# Altium schematic sheet ADC.SchDoc
size 558 x 431 mm; SheetNumber: 11; SheetTotal: 25; Sheet_Name: ADC; Size: 11x17
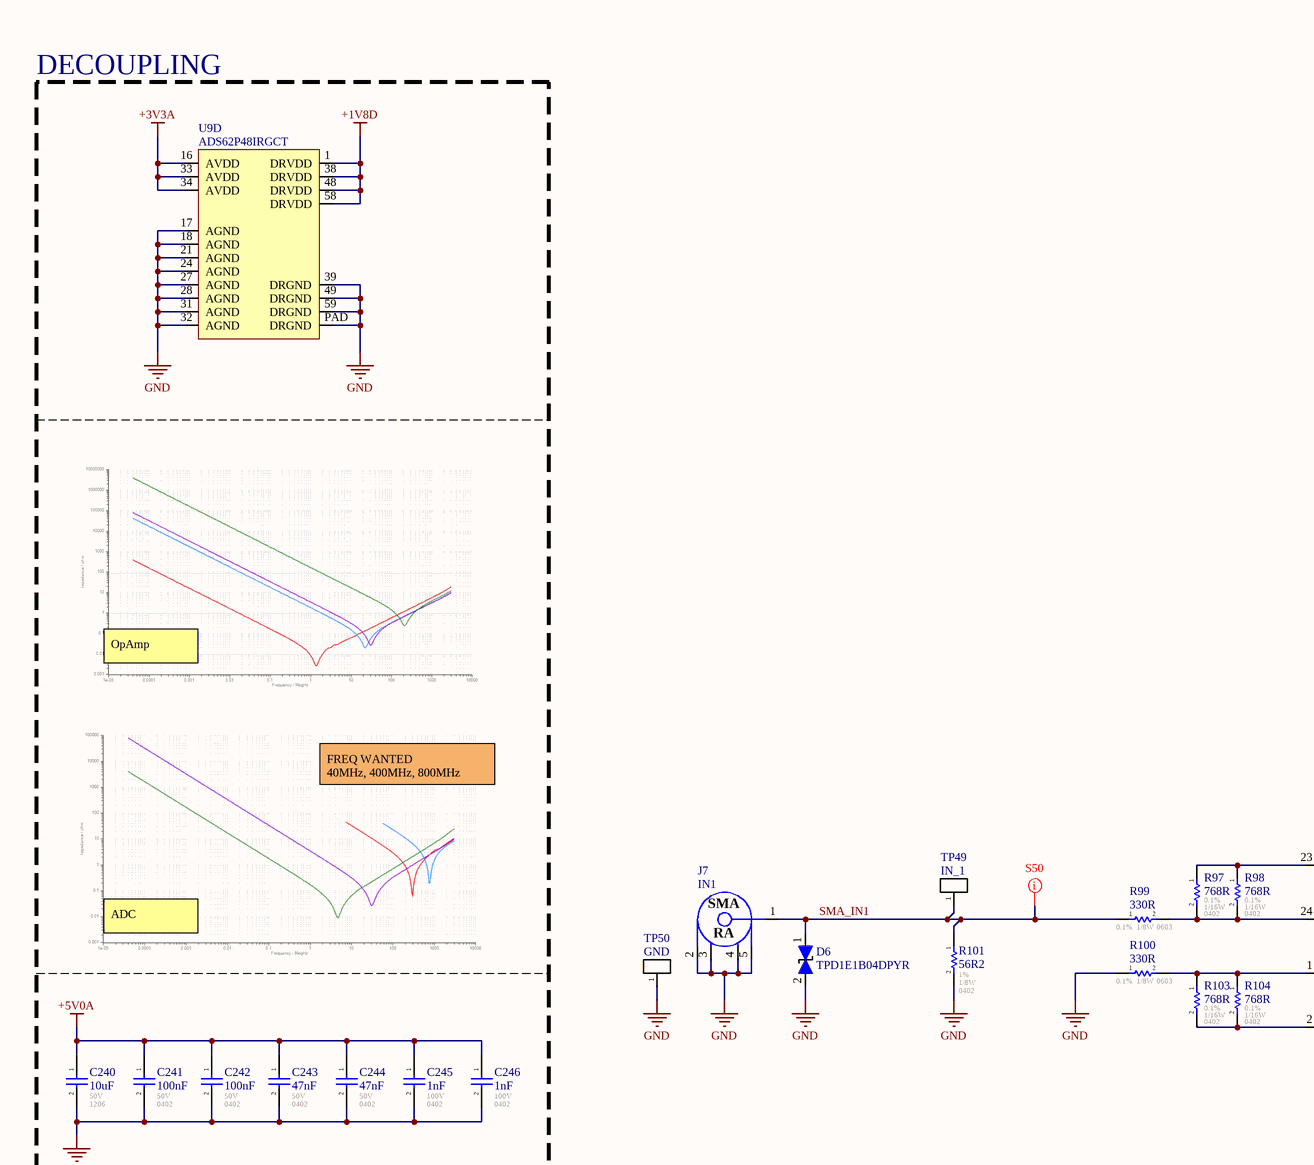
[diagram p0: ADC.SchDoc, top left]
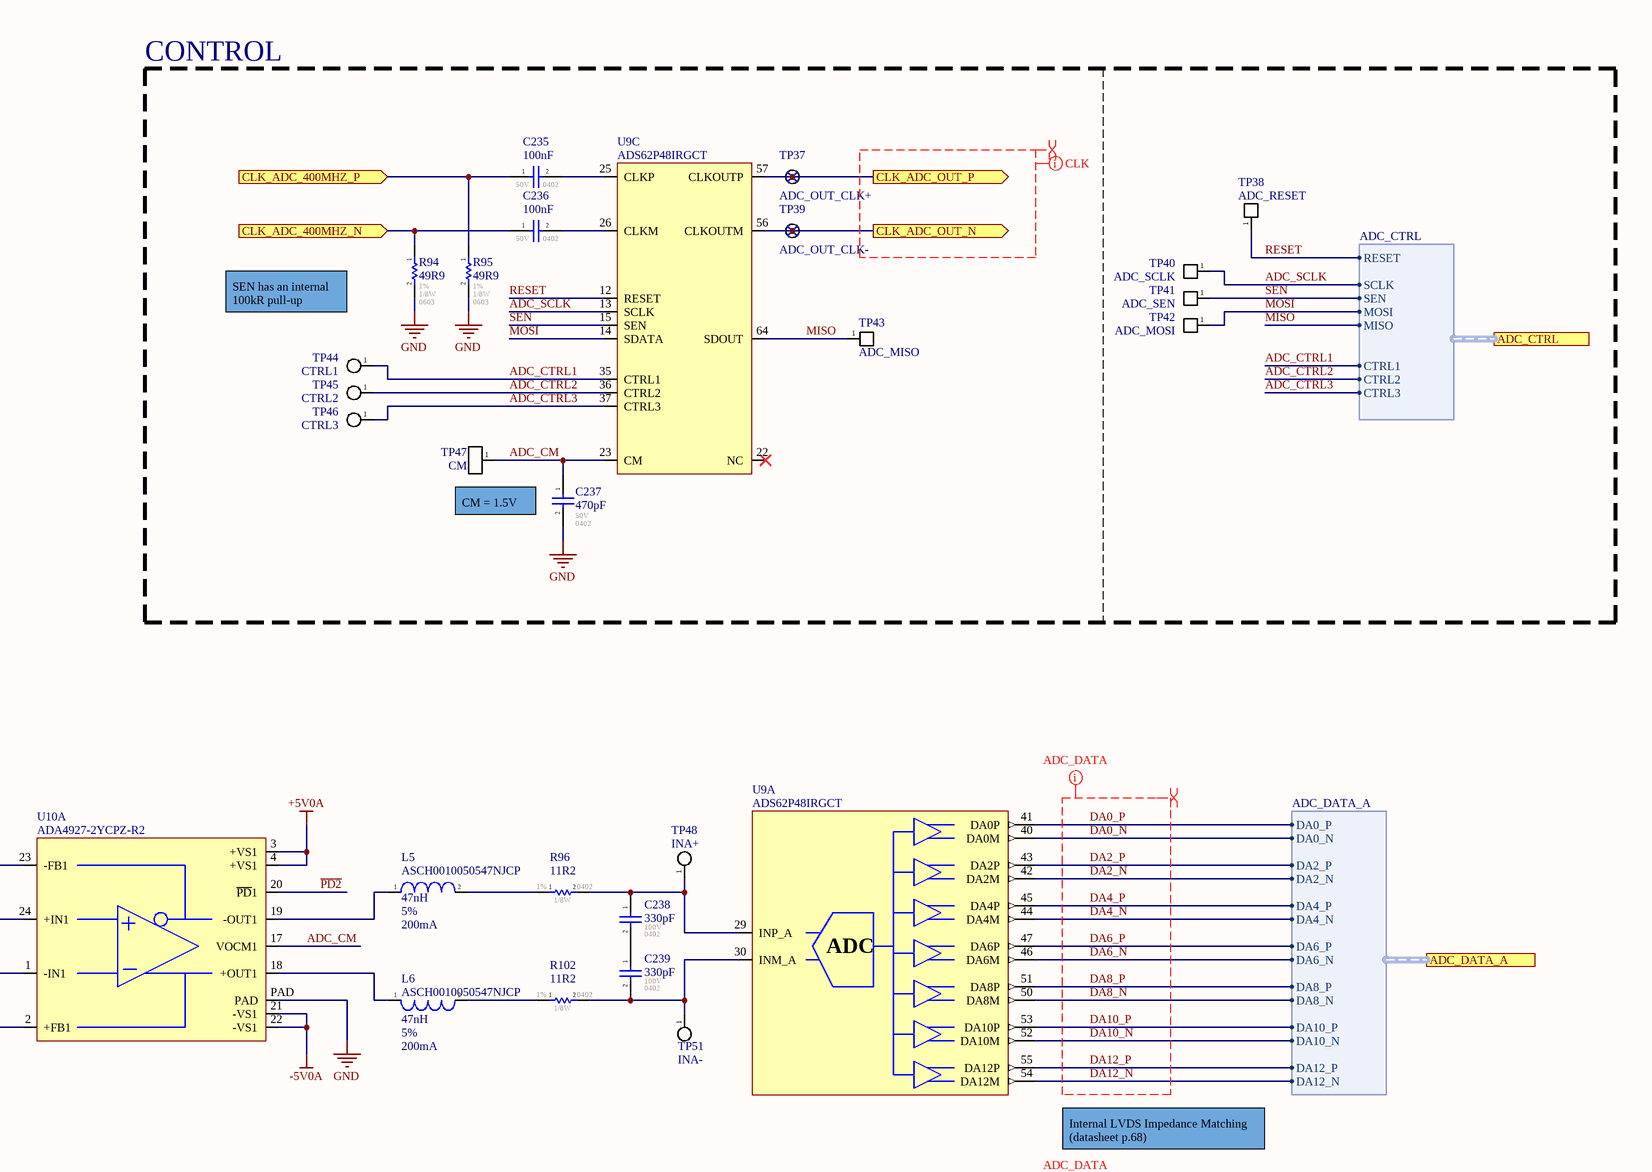
[diagram p1: ADC.SchDoc, top right]
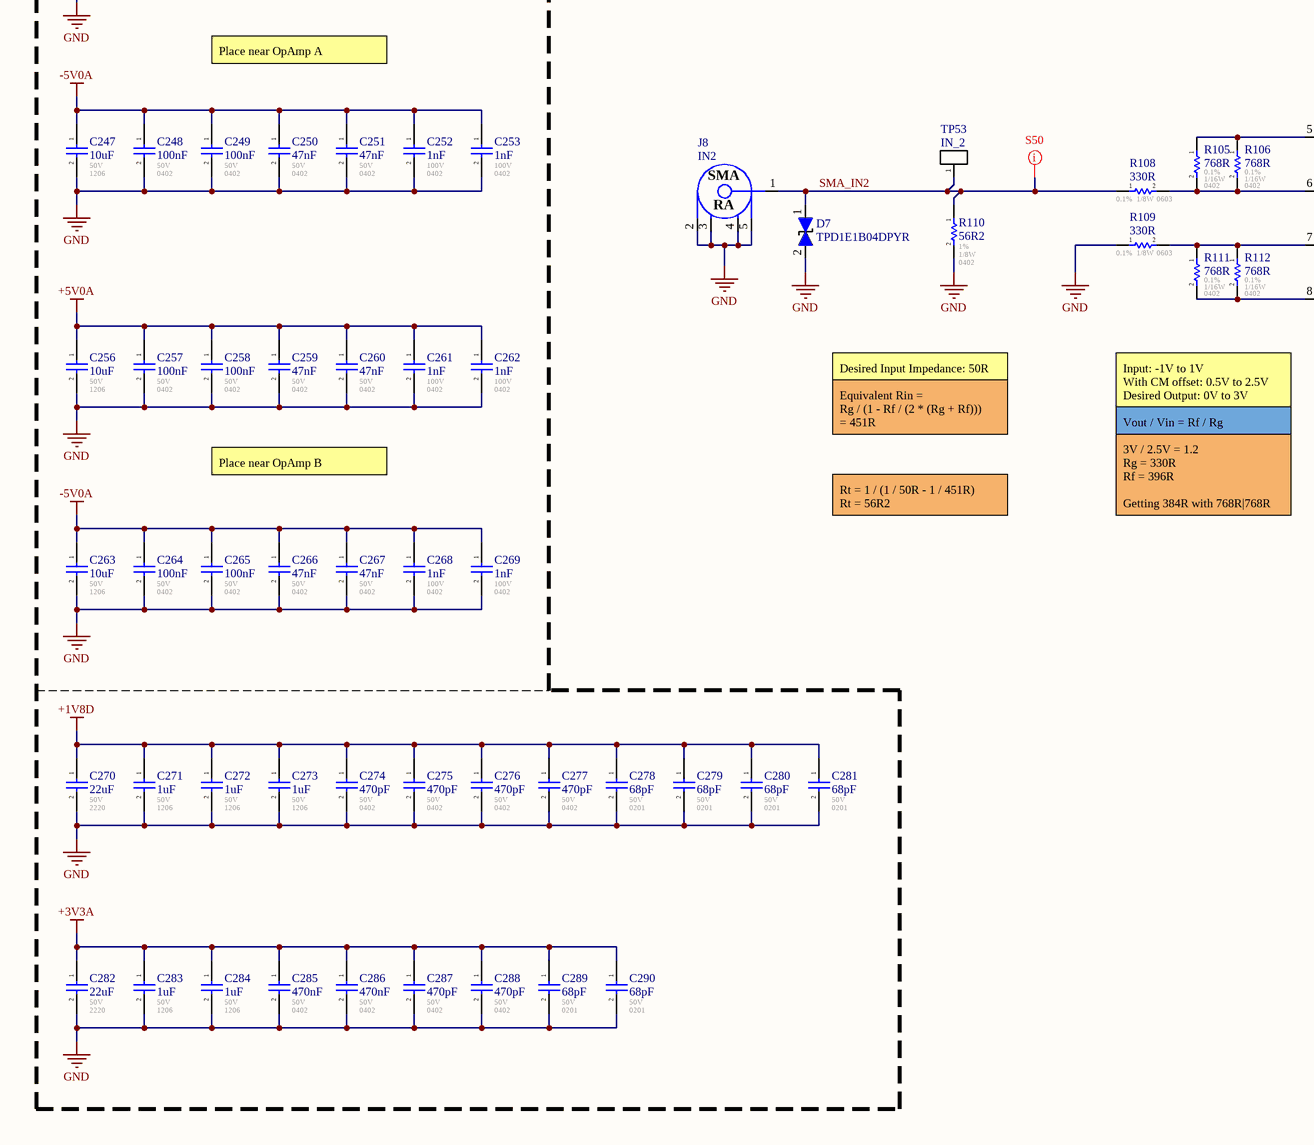
[diagram p2: ADC.SchDoc, bottom left]
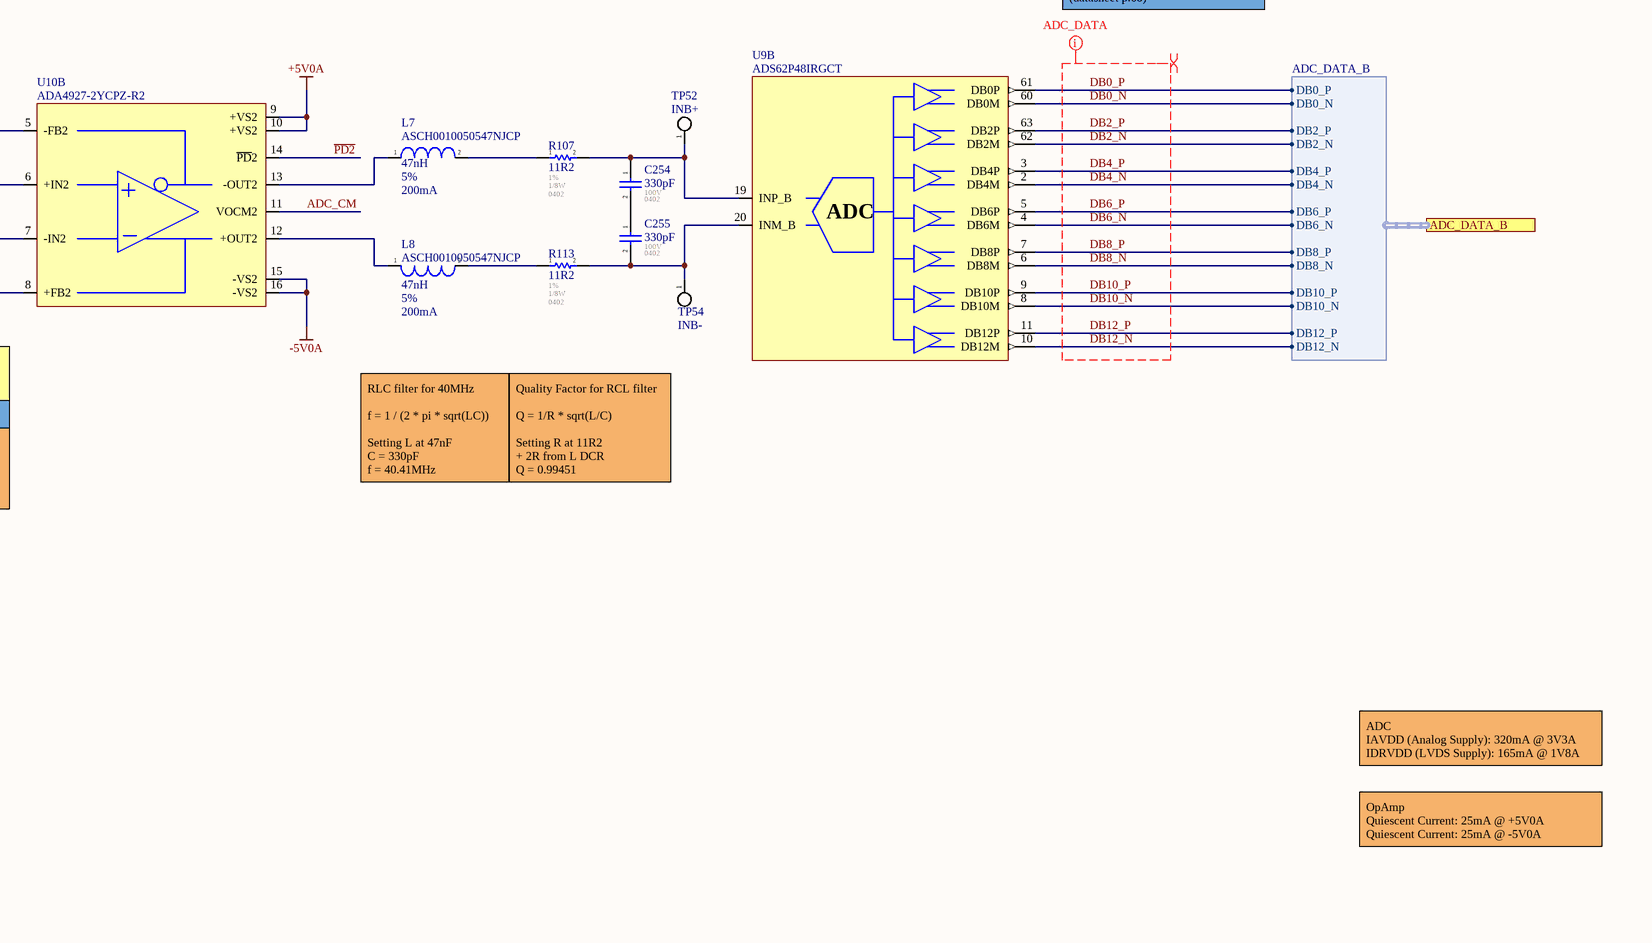
[diagram p3: ADC.SchDoc, bottom right]

## Parts
C235  100nF  Voltage - Rated: 50V  Footprint: 0402  [CAP_0402]
C236  100nF  Voltage - Rated: 50V  Footprint: 0402  [CAP_0402]
C237  470pF  Voltage - Rated: 50V  Footprint: 0402  [CAP_0402]
C238  330pF  Voltage - Rated: 100V  Footprint: 0402  [CAP_0402]
C239  330pF  Voltage - Rated: 100V  Footprint: 0402  [CAP_0402]
C240  10uF  Voltage - Rated: 50V  Footprint: 1206  [CAP_1206]
C241  100nF  Voltage - Rated: 50V  Footprint: 0402  [CAP_0402]
C242  100nF  Voltage - Rated: 50V  Footprint: 0402  [CAP_0402]
C243  47nF  Voltage - Rated: 50V  Footprint: 0402  [CAP_0402]
C244  47nF  Voltage - Rated: 50V  Footprint: 0402  [CAP_0402]
C245  1nF  Voltage - Rated: 100V  Footprint: 0402  [CAP_0402]
C246  1nF  Voltage - Rated: 100V  Footprint: 0402  [CAP_0402]
C247  10uF  Voltage - Rated: 50V  Footprint: 1206  [CAP_1206]
C248  100nF  Voltage - Rated: 50V  Footprint: 0402  [CAP_0402]
C249  100nF  Voltage - Rated: 50V  Footprint: 0402  [CAP_0402]
C250  47nF  Voltage - Rated: 50V  Footprint: 0402  [CAP_0402]
C251  47nF  Voltage - Rated: 50V  Footprint: 0402  [CAP_0402]
C252  1nF  Voltage - Rated: 100V  Footprint: 0402  [CAP_0402]
C253  1nF  Voltage - Rated: 100V  Footprint: 0402  [CAP_0402]
C254  330pF  Voltage - Rated: 100V  Footprint: 0402  [CAP_0402]
C255  330pF  Voltage - Rated: 100V  Footprint: 0402  [CAP_0402]
C256  10uF  Voltage - Rated: 50V  Footprint: 1206  [CAP_1206]
C257  100nF  Voltage - Rated: 50V  Footprint: 0402  [CAP_0402]
C258  100nF  Voltage - Rated: 50V  Footprint: 0402  [CAP_0402]
C259  47nF  Voltage - Rated: 50V  Footprint: 0402  [CAP_0402]
C260  47nF  Voltage - Rated: 50V  Footprint: 0402  [CAP_0402]
C261  1nF  Voltage - Rated: 100V  Footprint: 0402  [CAP_0402]
C262  1nF  Voltage - Rated: 100V  Footprint: 0402  [CAP_0402]
C263  10uF  Voltage - Rated: 50V  Footprint: 1206  [CAP_1206]
C264  100nF  Voltage - Rated: 50V  Footprint: 0402  [CAP_0402]
C265  100nF  Voltage - Rated: 50V  Footprint: 0402  [CAP_0402]
C266  47nF  Voltage - Rated: 50V  Footprint: 0402  [CAP_0402]
C267  47nF  Voltage - Rated: 50V  Footprint: 0402  [CAP_0402]
C268  1nF  Voltage - Rated: 100V  Footprint: 0402  [CAP_0402]
C269  1nF  Voltage - Rated: 100V  Footprint: 0402  [CAP_0402]
C270  22uF  Voltage - Rated: 50V  Footprint: 2220  [CAP_2220]
C271  1uF  Voltage - Rated: 50V  Footprint: 1206  [CAP_1206]
C272  1uF  Voltage - Rated: 50V  Footprint: 1206  [CAP_1206]
C273  1uF  Voltage - Rated: 50V  Footprint: 1206  [CAP_1206]
C274  470pF  Voltage - Rated: 50V  Footprint: 0402  [CAP_0402]
C275  470pF  Voltage - Rated: 50V  Footprint: 0402  [CAP_0402]
C276  470pF  Voltage - Rated: 50V  Footprint: 0402  [CAP_0402]
C277  470pF  Voltage - Rated: 50V  Footprint: 0402  [CAP_0402]
C278  68pF  Voltage - Rated: 50V  Footprint: 0201  [CAP_0402]
C279  68pF  Voltage - Rated: 50V  Footprint: 0201  [CAP_0402]
C280  68pF  Voltage - Rated: 50V  Footprint: 0201  [CAP_0402]
C281  68pF  Voltage - Rated: 50V  Footprint: 0201  [CAP_0402]
C282  22uF  Voltage - Rated: 50V  Footprint: 2220  [CAP_2220]
C283  1uF  Voltage - Rated: 50V  Footprint: 1206  [CAP_1206]
C284  1uF  Voltage - Rated: 50V  Footprint: 1206  [CAP_1206]
C285  470nF  Voltage - Rated: 50V  Footprint: 0402  [CAP_0402]
C286  470nF  Voltage - Rated: 50V  Footprint: 0402  [CAP_0402]
C287  470pF  Voltage - Rated: 50V  Footprint: 0402  [CAP_0402]
C288  470pF  Voltage - Rated: 50V  Footprint: 0402  [CAP_0402]
C289  68pF  Voltage - Rated: 50V  Footprint: 0201  [CAP_0402]
C290  68pF  Voltage - Rated: 50V  Footprint: 0201  [CAP_0402]
D6  TPD1E1B04DPYR  [TVS_DATA_TPD1E1B04DPYR]
D7  TPD1E1B04DPYR  [TVS_DATA_TPD1E1B04DPYR]
J7  IN1  [CONN_SMA_5-1814400-1]
J8  IN2  [CONN_SMA_5-1814400-1]
L5  ASCH0010050547NJCP  Inductance: 47nH  Tolerance: 5%  Current Rating: 200mA  [IND_0402]
L6  ASCH0010050547NJCP  Inductance: 47nH  Tolerance: 5%  Current Rating: 200mA  [IND_0402]
L7  ASCH0010050547NJCP  Inductance: 47nH  Tolerance: 5%  Current Rating: 200mA  [IND_0402]
L8  ASCH0010050547NJCP  Inductance: 47nH  Tolerance: 5%  Current Rating: 200mA  [IND_0402]
R94  49R9  Tolerance: 1%  Power: 1/8W  Package / Case: 0603  [RES_0603]
R95  49R9  Tolerance: 1%  Power: 1/8W  Package / Case: 0603  [RES_0603]
R96  11R2  Tolerance: 1%  Power: 1/8W  Package / Case: 0402  [RES_0402]
R97  768R  Tolerance: 0.1%  Power: 1/16W  Package / Case: 0402  [RES_0402]
R98  768R  Tolerance: 0.1%  Power: 1/16W  Package / Case: 0402  [RES_0402]
R99  330R  Tolerance: 0.1%  Power: 1/8W  Package / Case: 0603  [RES_0603]
R100  330R  Tolerance: 0.1%  Power: 1/8W  Package / Case: 0603  [RES_0603]
R101  56R2  Tolerance: 1%  Power: 1/8W  Package / Case: 0402  [RES_0402]
R102  11R2  Tolerance: 1%  Power: 1/8W  Package / Case: 0402  [RES_0402]
R103  768R  Tolerance: 0.1%  Power: 1/16W  Package / Case: 0402  [RES_0402]
R104  768R  Tolerance: 0.1%  Power: 1/16W  Package / Case: 0402  [RES_0402]
R105  768R  Tolerance: 0.1%  Power: 1/16W  Package / Case: 0402  [RES_0402]
R106  768R  Tolerance: 0.1%  Power: 1/16W  Package / Case: 0402  [RES_0402]
R107  11R2  Tolerance: 1%  Power: 1/8W  Package / Case: 0402  [RES_0402]
R108  330R  Tolerance: 0.1%  Power: 1/8W  Package / Case: 0603  [RES_0603]
R109  330R  Tolerance: 0.1%  Power: 1/8W  Package / Case: 0603  [RES_0603]
R110  56R2  Tolerance: 1%  Power: 1/8W  Package / Case: 0402  [RES_0402]
R111  768R  Tolerance: 0.1%  Power: 1/16W  Package / Case: 0402  [RES_0402]
R112  768R  Tolerance: 0.1%  Power: 1/16W  Package / Case: 0402  [RES_0402]
R113  11R2  Tolerance: 1%  Power: 1/8W  Package / Case: 0402  [RES_0402]
TP37  ADC_OUT_CLK+  [TP_PAD_TINY]  (no BOM)
TP38  ADC_RESET  [TP_PAD]  (no BOM)
TP39  ADC_OUT_CLK-  [TP_PAD_TINY]  (no BOM)
TP40  ADC_SCLK  [TP_PAD]  (no BOM)
TP41  ADC_SEN  [TP_PAD]  (no BOM)
TP42  ADC_MOSI  [TP_PAD]  (no BOM)
TP43  ADC_MISO  [TP_PAD]  (no BOM)
TP44  CTRL1  [TP_PAD_SMALL]  (no BOM)
TP45  CTRL2  [TP_PAD_SMALL]  (no BOM)
TP46  CTRL3  [TP_PAD_SMALL]  (no BOM)
TP47  CM  [TP_HOLE]  (no BOM)
TP48  INA+  [TP_PAD_SMALL]  (no BOM)
TP49  IN_1  [TP_HOLE]  (no BOM)
TP50  GND  [TP_HOLE]  (no BOM)
TP51  INA-  [TP_PAD_SMALL]  (no BOM)
TP52  INB+  [TP_PAD_SMALL]  (no BOM)
TP53  IN_2  [TP_HOLE]  (no BOM)
TP54  INB-  [TP_PAD_SMALL]  (no BOM)
U9  ADS62P48IRGCT  [ADC_ADS62P48IRGCT]  (parts A,B,C,D of 4)
U10  ADA4927-2YCPZ-R2  [OPAMP_ADA4927-2YCPZ-R2]  (parts A,B of 2)

## Blocks framed on the sheet
DECOUPLING: C240-C253 C256-C290 U9
CONTROL: C235-C237 R94 R95 TP37-TP47 U9

## Ports
ADC_CTRL (harness ADC_CTRL), ADC_DATA_A (harness ADC_DATA_A), ADC_DATA_B (harness ADC_DATA_B), CLK_ADC_400MHZ_N (in), CLK_ADC_400MHZ_P (in), CLK_ADC_OUT_N (out), CLK_ADC_OUT_P (out)

## Harnesses
ADC_DATA_A: DA0_P, DA0_N, DA2_P, DA2_N, DA4_P, DA4_N, DA6_P, DA6_N, DA8_P, DA8_N, DA10_P, DA10_N, DA12_P, DA12_N
ADC_DATA_B: DB0_P, DB0_N, DB2_P, DB2_N, DB4_P, DB4_N, DB6_P, DB6_N, DB8_P, DB8_N, DB10_P, DB10_N, DB12_P, DB12_N
ADC_CTRL: RESET, SCLK, SEN, MOSI, MISO, CTRL1, CTRL2, CTRL3

## Nets
+1V8D: C270.1 C271.1 C272.1 C273.1 C274.1 C275.1 C276.1 C277.1 C278.1 C279.1 C280.1 C281.1 U9.1(DRVDD) U9.38(DRVDD) U9.48(DRVDD) U9.58(DRVDD)
+3V3A: C282.1 C283.1 C284.1 C285.1 C286.1 C287.1 C288.1 C289.1 C290.1 U9.16(AVDD) U9.33(AVDD) U9.34(AVDD)
+5V0A: C240.1 C241.1 C242.1 C243.1 C244.1 C245.1 C246.1 C256.1 C257.1 C258.1 C259.1 C260.1 C261.1 C262.1 U10.3(+VS1) U10.4(+VS1) U10.9(+VS2) U10.10(+VS2)
-5V0A: C247.1 C248.1 C249.1 C250.1 C251.1 C252.1 C253.1 C263.1 C264.1 C265.1 C266.1 C267.1 C268.1 C269.1 U10.15(-VS2) U10.16(-VS2) U10.21(-VS1) U10.22(-VS1)
GND: C237.2 C240.2 C241.2 C242.2 C243.2 C244.2 C245.2 C246.2 C247.2 C248.2 C249.2 C250.2 C251.2 C252.2 C253.2 C256.2 C257.2 C258.2 C259.2 C260.2 C261.2 C262.2 C263.2 C264.2 C265.2 C266.2 C267.2 C268.2 C269.2 C270.2 C271.2 C272.2 C273.2 C274.2 C275.2 C276.2 C277.2 C278.2 C279.2 C280.2 C281.2 C282.2 C283.2 C284.2 C285.2 C286.2 C287.2 C288.2 C289.2 C290.2 D6.2(i/o) D7.2(i/o) J7.2 J7.3 J7.4 J7.5 J8.2 J8.3 J8.4 J8.5 R94.2 R95.2 R100.1 R101.2 R109.1 R110.2 TP50.1(A) U9.17(AGND) U9.18(AGND) U9.21(AGND) U9.24(AGND) U9.27(AGND) U9.28(AGND) U9.31(AGND) U9.32(AGND) U9.39(DRGND) U9.49(DRGND) U9.59(DRGND) U9.PAD(DRGND) U10.PAD
~{PD2}: U10.14(~{PD}2) U10.20(~{PD}1)
ADC_CM: C237.1 TP47.1(A) U9.23(CM) U10.11(VOCM2) U10.17(VOCM1)
ADC_CTRL1: TP44.1(A) U9.35(CTRL1) ; port ADC_CTRL.CTRL1
ADC_CTRL2: TP45.1(A) U9.36(CTRL2) ; port ADC_CTRL.CTRL2
ADC_CTRL3: TP46.1(A) U9.37(CTRL3) ; port ADC_CTRL.CTRL3
ADC_SCLK: TP40.1(A) U9.13(SCLK) ; port ADC_CTRL.SCLK
CLK_ADC_400MHZ_N: C236.1 R94.1 ; port CLK_ADC_400MHZ_N
CLK_ADC_400MHZ_P: C235.1 R95.1 ; port CLK_ADC_400MHZ_P
CLK_ADC_OUT_N: TP39.1(A) U9.56(CLKOUTM) ; port CLK_ADC_OUT_N
CLK_ADC_OUT_P: TP37.1(A) U9.57(CLKOUTP) ; port CLK_ADC_OUT_P
DA0_N: U9.40(DA0M) ; port ADC_DATA_A.DA0_N
DA0_P: U9.41(DA0P) ; port ADC_DATA_A.DA0_P
DA2_N: U9.42(DA2M) ; port ADC_DATA_A.DA2_N
DA2_P: U9.43(DA2P) ; port ADC_DATA_A.DA2_P
DA4_N: U9.44(DA4M) ; port ADC_DATA_A.DA4_N
DA4_P: U9.45(DA4P) ; port ADC_DATA_A.DA4_P
DA6_N: U9.46(DA6M) ; port ADC_DATA_A.DA6_N
DA6_P: U9.47(DA6P) ; port ADC_DATA_A.DA6_P
DA8_N: U9.50(DA8M) ; port ADC_DATA_A.DA8_N
DA8_P: U9.51(DA8P) ; port ADC_DATA_A.DA8_P
DA10_N: U9.52(DA10M) ; port ADC_DATA_A.DA10_N
DA10_P: U9.53(DA10P) ; port ADC_DATA_A.DA10_P
DA12_N: U9.54(DA12M) ; port ADC_DATA_A.DA12_N
DA12_P: U9.55(DA12P) ; port ADC_DATA_A.DA12_P
DB0_N: U9.60(DB0M) ; port ADC_DATA_B.DB0_N
DB0_P: U9.61(DB0P) ; port ADC_DATA_B.DB0_P
DB2_N: U9.62(DB2M) ; port ADC_DATA_B.DB2_N
DB2_P: U9.63(DB2P) ; port ADC_DATA_B.DB2_P
DB4_N: U9.2(DB4M) ; port ADC_DATA_B.DB4_N
DB4_P: U9.3(DB4P) ; port ADC_DATA_B.DB4_P
DB6_N: U9.4(DB6M) ; port ADC_DATA_B.DB6_N
DB6_P: U9.5(DB6P) ; port ADC_DATA_B.DB6_P
DB8_N: U9.6(DB8M) ; port ADC_DATA_B.DB8_N
DB8_P: U9.7(DB8P) ; port ADC_DATA_B.DB8_P
DB10_N: U9.8(DB10M) ; port ADC_DATA_B.DB10_N
DB10_P: U9.9(DB10P) ; port ADC_DATA_B.DB10_P
DB12_N: U9.10(DB12M) ; port ADC_DATA_B.DB12_N
DB12_P: U9.11(DB12P) ; port ADC_DATA_B.DB12_P
MISO: TP43.1(A) U9.64(SDOUT) ; port ADC_CTRL.MISO
MOSI: TP42.1(A) U9.14(SDATA) ; port ADC_CTRL.MOSI
RESET: TP38.1(A) U9.12(RESET) ; port ADC_CTRL.RESET
SEN: TP41.1(A) U9.15(SEN) ; port ADC_CTRL.SEN
SMA_IN1: D6.1(i/o) J7.1 R99.1 R101.1 TP49.1(A)
SMA_IN2: D7.1(i/o) J8.1 R108.1 R110.1 TP53.1(A)
NetC235_2: C235.2 U9.25(CLKP)
NetC236_2: C236.2 U9.26(CLKM)
NetC238_1: C238.1 R96.2 TP48.1(A) U9.29(INP_A)
NetC238_2: C238.2 C239.1
NetC239_2: C239.2 R102.2 TP51.1(A) U9.30(INM_A)
NetC254_1: C254.1 R107.2 TP52.1(A) U9.19(INP_B)
NetC254_2: C254.2 C255.1
NetC255_2: C255.2 R113.2 TP54.1(A) U9.20(INM_B)
NetL5_1: L5.1 U10.19(-OUT1)
NetL5_2: L5.2 R96.1
NetL6_1: L6.1 U10.18(+OUT1)
NetL6_2: L6.2 R102.1
NetL7_1: L7.1 U10.13(-OUT2)
NetL7_2: L7.2 R107.1
NetL8_1: L8.1 U10.12(+OUT2)
NetL8_2: L8.2 R113.1
NetR97_1: R97.1 R98.1 U10.23(-FB1)
NetR97_2: R97.2 R98.2 R99.2 U10.24(+IN1)
NetR100_2: R100.2 R103.1 R104.1 U10.1(-IN1)
NetR103_2: R103.2 R104.2 U10.2(+FB1)
NetR105_1: R105.1 R106.1 U10.5(-FB2)
NetR105_2: R105.2 R106.2 R108.2 U10.6(+IN2)
NetR109_2: R109.2 R111.1 R112.1 U10.7(-IN2)
NetR111_2: R111.2 R112.2 U10.8(+FB2)

Not connected (* = marked no-connect by the designer): U9 22(NC)*

## Layout directives
net class CLK; net class ADC_DATA: (no net found under the mark)
differential pair: (no net found under the mark), DA0_N, DA0_P, DA2_N, DA2_P, DA4_N, DA4_P, DA6_N, DA6_P, DA8_N, DA8_P, DA10_N, DA10_P, DA12_N, DA12_P, DB0_N, DB0_P, DB2_N, DB2_P, DB4_N, DB4_P, DB6_N, DB6_P, DB8_N, DB8_P, DB10_N, DB10_P, DB12_N, DB12_P
net class S50: SMA_IN1, SMA_IN2
net class ADC_DATA: DA0_N, DA0_P, DA2_N, DA2_P, DA4_N, DA4_P, DA6_N, DA6_P, DA8_N, DA8_P, DA10_N, DA10_P, DA12_N, DA12_P, DB0_N, DB0_P, DB2_N, DB2_P, DB4_N, DB4_P, DB6_N, DB6_P, DB8_N, DB8_P, DB10_N, DB10_P, DB12_N, DB12_P

## Notes on the sheet
- SEN has an internal 100kR pull-up
- CM = 1.5V
- OpAmp
- FREQ WANTED
  40MHz, 400MHz, 800MHz
- ADC
- Internal LVDS Impedance Matching
  (datasheet p.68)
- Place near OpAmp A
- Desired Input Impedance: 50R
- Equivalent Rin =
  Rg / (1 - Rf / (2 * (Rg + Rf)))
  = 451R
- Input: -1V to 1V
  With CM offset: 0.5V to 2.5V
  Desired Output: 0V to 3V
- Vout / Vin = Rf / Rg
- Place near OpAmp B
- Rt = 1 / (1 / 50R - 1 / 451R)
  Rt = 56R2
- 3V / 2.5V = 1.2
  Rg = 330R
  Rf = 396R
  Getting 384R with 768R|768R
- RLC filter for 40MHz
  f = 1 / (2 * pi * sqrt(LC))
  Setting L at 47nF
  C = 330pF
  f = 40.41MHz
- Quality Factor for RCL filter
  Q = 1/R * sqrt(L/C)
  Setting R at 11R2
  + 2R from L DCR
  Q = 0.99451
- ADC
  IAVDD (Analog Supply): 320mA @ 3V3A
  IDRVDD (LVDS Supply): 165mA @ 1V8A
- OpAmp
  Quiescent Current: 25mA @ +5V0A
  Quiescent Current: 25mA @ -5V0A
- Sheet Name
- Project Title
- Global Project
- Revision
- Size
- Date
- Group
- Sheet
- of
- Filename
- Designers
- (in symbol ADC_ADS62P48IRGCT, part A) ADC
- (in symbol ADC_ADS62P48IRGCT, part B) ADC
- (in symbol CONN_SMA_5-1814400-1) SMA; RA

## Library data of the parts
C235 C236 C241 C242 C248 C249 C257 C258 C264 C265 = CAP_CER: GCM155R71H104KE02J / 0402 100nF 10% X7R Ceramic Capacitor; Mfr: Murata; Operating Temperature: -55C - 125C; Temperature Coefficient: X7R; ComponentLink1Description: Digikey; ComponentLink1URL: [Digikey Link]; Part#: GCM155R71H104KE02J; ComponentLink2Description: Datasheet; ComponentLink2URL: [Datasheet Link]; Tolerance: 10%; Ratings: AEC-Q200
C237 C274-C277 C287 C288 = CAP_CER: GCM155R71H471KA37J / 0402 470pF 10% X7R Ceramic Capacitor; Mfr: Murata; Operating Temperature: -55C - 125C; Temperature Coefficient: X7R; ComponentLink1Description: Digikey; ComponentLink1URL: https://www.digikey.ca/en/products/detail/murata-electronics/GCM155R71H471KA37J/2591324; Part#: GCM155R71H471KA37J; ComponentLink2Description: Datasheet; ComponentLink2URL: https://search.murata.co.jp/Ceramy/image/img/A01X/G101/ENG/GCM155R71H471KA37-01A.pdf; Tolerance: 10%; Ratings: AEC-Q200; ComponentLink3Description: Murata; ComponentLink3URL: https://www.murata.com/en-us/products/productdetail?partno=GCM155R71H471KA37%23; ComponentLink4Description: Octopart; ComponentLink4URL: https://octopart.com/gcm155r71h471ka37j-murata-17803389?r=sp
C238 C239 C254 C255 = CAP_CER: GCM155R72A331KA37D / 0402 330pF 10% X7R Ceramic Capacitor; Mfr: Murata; Operating Temperature: -55C - 125C; Temperature Coefficient: X7R; ComponentLink1Description: Digikey; ComponentLink1URL: https://www.digikey.ca/en/products/detail/murata-electronics/GCM155R72A331KA37D/2591348; Part#: GCM155R72A331KA37D; ComponentLink2Description: Datasheet; ComponentLink2URL: https://search.murata.co.jp/Ceramy/image/img/A01X/G101/ENG/GCM155R72A331KA37-01A.pdf; Tolerance: 10%; Ratings: AEC-Q200; ComponentLink3Description: Murata; ComponentLink3URL: https://www.murata.com/en-us/products/productdetail?partno=GCM155R72A331KA37%23; ComponentLink4Description: Octopart; ComponentLink4URL: https://octopart.com/gcm155r72a331ka37d-murata-18331888?r=sp; Supplier 1: Arrow Electronics; Supplier Part Number 1: GCM155R72A331KA37D
C240 C247 C256 C263 = CAP_CER: GRT31CR61H106KE01L / 1206 10uF 10% X5R Ceramic Capacitor; Mfr: Murata; Operating Temperature: -55C - 85C; Temperature Coefficient: X5R; ComponentLink1Description: Digikey; ComponentLink1URL: [Digikey Link]; ComponentLink2Description: Datasheet; ComponentLink2URL: [Datasheet Link]; Tolerance: 10%; Ratings: AEC-Q200; Supplier 1: Arrow Electronics; Supplier Part Number 1: GRT31CR61H106KE01L; Part#: GRT31CR61H106KE01L
C243 C244 C250 C251 C259 C260 C266 C267 = CAP_CER: GCM155R71H473KE02J / 0402 47nF 10% X7R Ceramic Capacitor; Mfr: Murata; Operating Temperature: -55C - 125C; Temperature Coefficient: X7R; ComponentLink1Description: Digikey; ComponentLink1URL: [Digikey Link]; Part#: GCM155R71H473KE02J; ComponentLink2Description: Datasheet; ComponentLink2URL: [Datasheet Link]; Tolerance: 10%; Ratings: AEC-Q200
C245 C246 C252 C253 C261 C262 C268 C269 = CAP_CER: GCM155R72A102KA37D / 0402 1nF 10% X7R Ceramic Capacitor; Mfr: Murata; Operating Temperature: -55C - 125C; Temperature Coefficient: X7R; ComponentLink1Description: Digikey; ComponentLink1URL: [Digikey Link]; Part#: GCM155R72A102KA37D; ComponentLink2Description: Datasheet; ComponentLink2URL: [Datasheet Link]; Tolerance: 10%; Ratings: AEC-Q200
C270 C282 = CAP_CER: CGA9P3X7R1H226M250KB / 2220 22uF 20% X7R Ceramic Capacitor; Mfr: TDK; Operating Temperature: -55C - 125C; Temperature Coefficient: X7R; ComponentLink1Description: Digikey; ComponentLink1URL: https://www.digikey.ca/en/products/detail/tdk-corporation/CGA9P3X7R1H226M250KB/10240627; ComponentLink2Description: Datasheet; ComponentLink2URL: https://product.tdk.com/system/files/dam/doc/product/capacitor/ceramic/mlcc/charasheet/cga9p3x7r1h226m250kb.pdf; Tolerance: 20%; Ratings: AEC-Q200; Part#: CGA9P3X7R1H226M250KB; Supplier 1: Arrow Electronics; Supplier Part Number 1: CGA9P3X7R1H226M250KB; ComponentLink3Description: TDK; ComponentLink3URL: https://product.tdk.com/en/search/capacitor/ceramic/mlcc/info?part_no=CGA9P3X7R1H226M250KB; ComponentLink4Description: Octopart; ComponentLink4URL: https://octopart.com/cga9p3x7r1h226m250kb-tdk-102764996?r=sp
C271-C273 C283 C284 = CAP_CER: GCJ31CR71H105KA12L / 1206 1uF 10% X7R Ceramic Capacitor; Mfr: Murata; Operating Temperature: -55C - 125C; Temperature Coefficient: X7R; ComponentLink1Description: Digikey; ComponentLink1URL: [Digikey Link]; Part#: GCJ31CR71H105KA12L; ComponentLink2Description: Datasheet; ComponentLink2URL: [Datasheet Link]; Tolerance: 10%; Ratings: AEC-Q200
C278-C281 C289 C290 = CAP_CER: 0201 68pF 5% C0G 50V Ceramic Capacitor / CGA1A2C0G1H680J030BA; Mfr: TDK; Operating Temperature: -55C - 125C; Temperature Coefficient: C0G; ComponentLink1Description: Digikey; ComponentLink1URL: https://www.digikey.ca/en/products/detail/tdk-corporation/CGA1A2C0G1H680J030BA/3648597; Part#: CGA1A2C0G1H680J030BA; ComponentLink2Description: Datasheet; ComponentLink2URL: https://product.tdk.com/system/files/dam/doc/product/capacitor/ceramic/mlcc/charasheet/cga1a2c0g1h680j030ba.pdf; Tolerance: 5%; Ratings: AEC-Q200; ComponentLink3Description: Octopart; ComponentLink3URL: https://octopart.com/cga1a2c0g1h680j030ba-tdk-26014371?r=sp; ComponentLink4Description: TDK; ComponentLink4URL: https://product.tdk.com/en/search/capacitor/ceramic/mlcc/info?part_no=CGA1A2C0G1H680J030BA; Supplier 1: Arrow Electronics; Supplier Part Number 1: CGA1A2C0G1H680J030BA
C285 C286 = CAP_CER: CGA3E3X7R1H474K080AB / 0603 470nF 10% X7R Ceramic Capacitor; Mfr: TDK; Operating Temperature: -55C - 125C; Temperature Coefficient: X7R; ComponentLink1Description: Digikey; ComponentLink1URL: [Digikey Link]; Part#: CGA3E3X7R1H474K080AB; ComponentLink2Description: Datasheet; ComponentLink2URL: [Datasheet Link]; Tolerance: 10%; Ratings: AEC-Q200
D6 D7 = TVS_DATA_TPD1E1B04DPYR: TVS - TVS DIODE 3.6V 8.5V - 0402; Manufacturer #1: Texas Instruments; Current Rating: 6.3Apeak; Power Max: 50Wpeak; GRAMS Lib Spec: 2.8; Magnetic Material: Unknown; Polarized: No; Value: *; Tolerance: *; Voltage Rating: 3.6V; HelpURL: http://www.ti.com/lit/ds/symlink/tpd1e1b04.pdf; CreatedBy/Date: Keven Deslandes - 2018/10/19; VerifiedBy: Caroline Paulin - 28 janv 2019; Temperature: -40°C ~ 125°C (TA); Package: 0402; Manufacturer #2: *; Note: *; Assembly Type: SMD; Part Number #2: *; Part Number #1: TPD1E1B04DPYR; Supplier 1: Digi-Key; Supplier Part Number 1: 296-47364-1-ND; Cryo: UNKNOWN
J7 J8 = CONN_SMA_5-1814400-1: 5-1814400-1 / CONN -  SMA JACK R/A 50 OHM - TH; Mfg: TE Connectivity AMP Connectors; Voltage: *; Current: *; Power: *; Mfg Part Number: 5-1814400-1; HelpURL: http://www.te.com/commerce/DocumentDelivery/DDEController?Action=srchrtrv&DocNm=1814400&DocType=Customer+Drawing&DocLang=English; CreatedBy: Jonathan Bouchard; Temperature: -55°C ~ 85°C; Value: *; Precision: *; Package: TH-5; Supplier 1: Digikey; Supplier Part Number 1: A97593-ND
L5-L8 = INDUCTOR: Generic Inductor; Material: Ceramic; Resistance: 2R; Q @ Freq: 8 @ 100MHz; Operating Temperature: -40C - 125C; Package / Case: 0402; Ratings: AEC-Q200; ComponentLink1Description: Digikey; ComponentLink1URL: https://www.digikey.ca/en/products/detail/pulse-electronics/asch0010050547njcp/16505828; ComponentLink2Description: Datasheet; ComponentLink2URL: https://productfinder.pulseelectronics.com/api/open/part-attachments/datasheet/ASCH0010050547NJCP; ComponentLink3Description: Octopart; ComponentLink3URL: https://octopart.com/asch0010050547njcp-pulse-128075783?r=sp; Supplier 1: Mouser; Supplier Part Number 1: 673-ASCH10050547NJCP
R94-R98 R101-R107 R110-R113 = RESISTOR: Automotive: AEC-Q200; Operating Temperature: *; # Digikey: *; ComponentLink1Description: Digikey; ComponentLink1URL: *; # Manufacturer: *
R99 R100 R108 R109 = RESISTOR: 1M 0603 1% 1/16W Resistor; Automotive: AEC-Q200; Operating Temperature: *; # Digikey: *; ComponentLink1Description: Digikey; ComponentLink1URL: *; # Manufacturer: *
TP37 TP39 = TESTPOINT_PAD_TINY: Test Point
TP38 TP40-TP43 = TESTPOINT_PAD: Test Point
TP44-TP46 TP48 TP51 TP52 TP54 = TESTPOINT_PAD_SMALL: Test Point
TP47 TP49 TP50 TP53 = TESTPOINT: Test Point; ClassName: Testpoint
U9 = ADC_ADS62P48IRGCT: ADC - 14 BIT 210MSPS SUAL - VQFN-64; Voltage: 3.15 V ~ 3.6 V / 1.7 V ~ 1.9 V; Mfg: Texas Instruments; Precision: 14 Bit; Current: *; Power: *; Mfg Part Number: ADS62P48IRGCT; HelpURL: http://www.ti.com/lit/ds/symlink/ads62p48.pdf; CreatedBy: Jonathan Bouchard; Temperature: -40°C ~ 85°C; Value: *; Package: VQFN-64; Supplier 1: Digikey; Supplier Part Number 1: 296-24611-1-ND
U10 = OPAMP_ADA4927-2YCPZ-R2: OPAMP - CFA 2.3GHZ - QFN-24; Voltage: 4.5 V ~ 11 V, ±2.25 V ~ 5.5 V; Current: 65mA; Mfg: Analog Devices; Power: *; Mfg Part Number: ADA4927-2YCPZ-R2; HelpURL: http://www.analog.com/media/en/technical-documentation/data-sheets/ADA4927-1_4927-2.pdf; CreatedBy: Jonathan Bouchard; Temperature: -40°C ~ 105°C; Value: *; Precision: *; Package: QFN-24; Supplier 1: Digikey; Supplier Part Number 1: ADA4927-2YCPZ-R2CT-ND